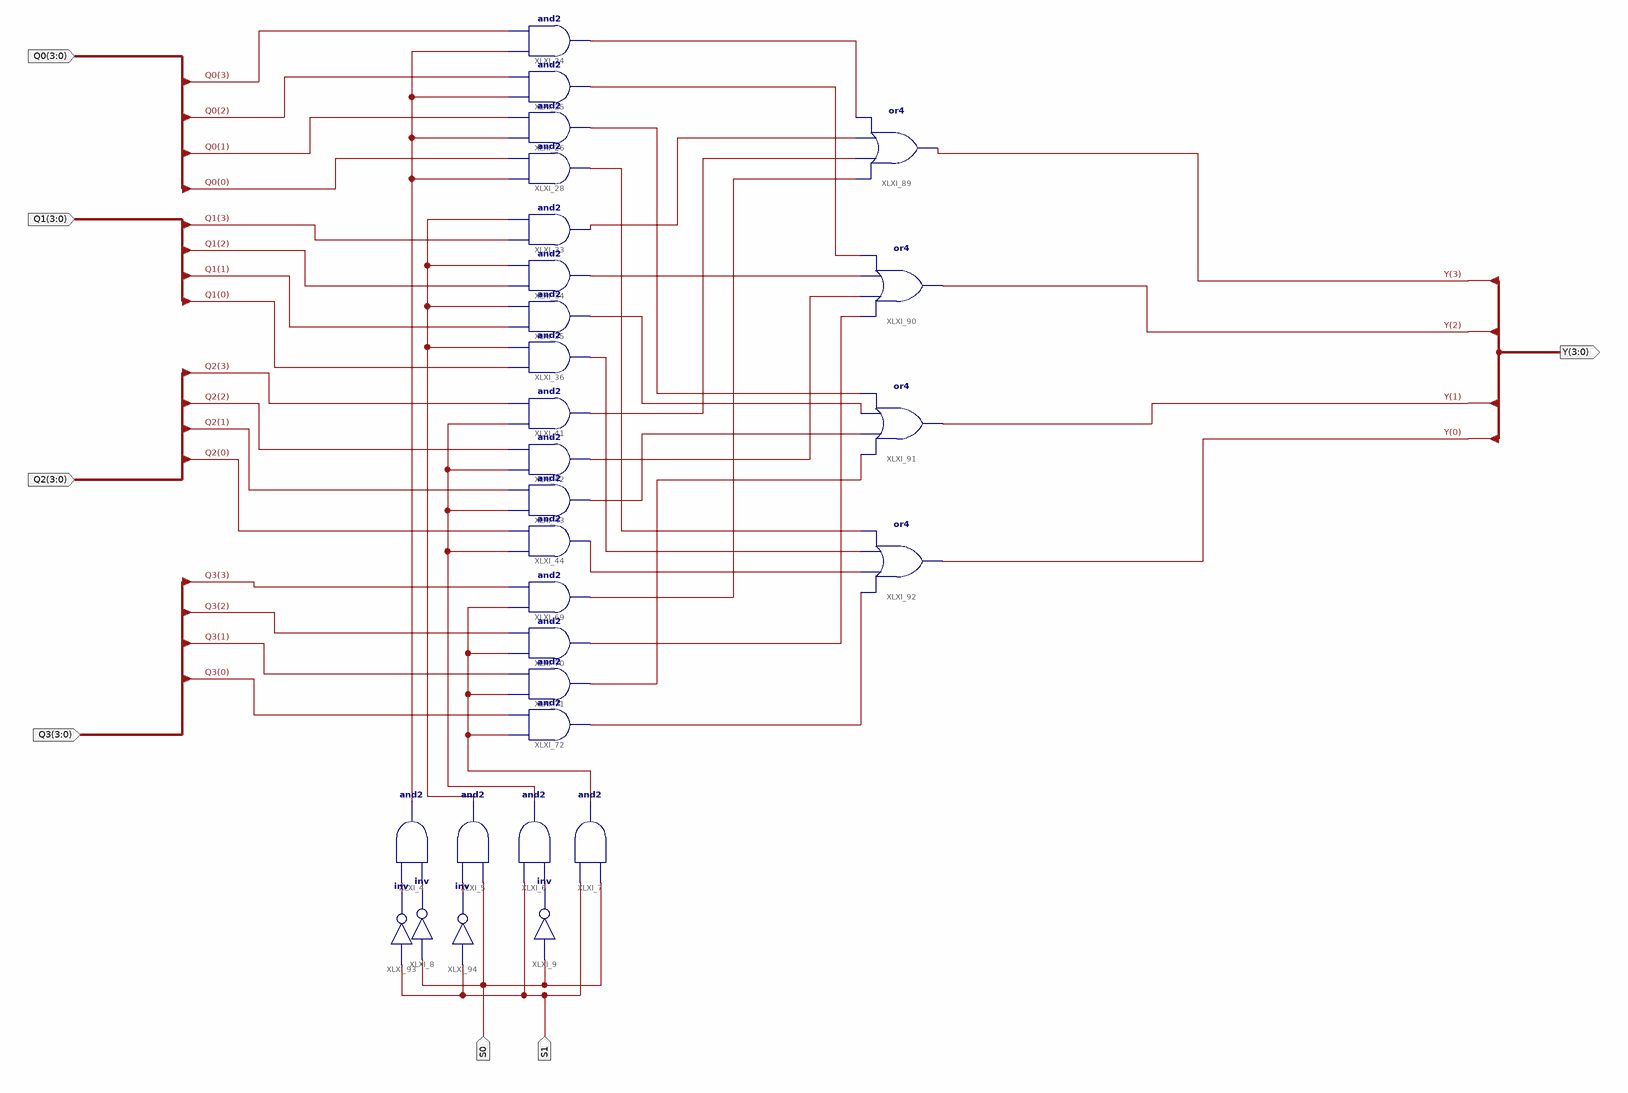
[diagram p0: schematic sheet 1]
// Xilinx ISE schematic MUX4_1_4.sch (spartan6) as structural Verilog: 28 symbols, 7 ports
module MUX4_1_4 (
  input  [3:0] Q0,
  input  [3:0] Q1,
  input  S0,
  input  S1,
  input  [3:0] Q2,
  input  [3:0] Q3,
  output [3:0] Y
);

  wire XLXN_80, XLXN_83, XLXN_121, XLXN_142, XLXN_148, XLXN_150, XLXN_158, XLXN_159, XLXN_160, XLXN_161,
       XLXN_162, XLXN_163, XLXN_164, XLXN_165, XLXN_173, XLXN_174, XLXN_175, XLXN_180, XLXN_182, XLXN_183,
       XLXN_184, XLXN_185, XLXN_190, XLXN_191;

  and XLXI_4 (XLXN_121, XLXN_80, XLXN_190);
  and XLXI_5 (XLXN_142, S0, XLXN_191);
  and XLXI_6 (XLXN_148, XLXN_83, S1);
  and XLXI_7 (XLXN_150, S0, S1);
  not XLXI_8 (XLXN_80, S0);
  not XLXI_9 (XLXN_83, S0);
  and XLXI_24 (XLXN_158, XLXN_121, Q0[3]);
  and XLXI_25 (XLXN_162, XLXN_121, Q0[2]);
  and XLXI_26 (XLXN_173, XLXN_121, Q0[1]);
  and XLXI_28 (XLXN_182, XLXN_121, Q0[0]);
  and XLXI_33 (XLXN_159, Q1[3], XLXN_142);
  and XLXI_34 (XLXN_163, Q1[2], XLXN_142);
  and XLXI_35 (XLXN_174, Q1[1], XLXN_142);
  and XLXI_36 (XLXN_183, Q1[0], XLXN_142);
  and XLXI_41 (XLXN_160, XLXN_148, Q2[3]);
  and XLXI_42 (XLXN_164, XLXN_148, Q2[2]);
  and XLXI_43 (XLXN_175, XLXN_148, Q2[1]);
  and XLXI_44 (XLXN_184, XLXN_148, Q2[0]);
  and XLXI_69 (XLXN_161, XLXN_150, Q3[3]);
  and XLXI_70 (XLXN_165, XLXN_150, Q3[2]);
  and XLXI_71 (XLXN_180, XLXN_150, Q3[1]);
  and XLXI_72 (XLXN_185, XLXN_150, Q3[0]);
  or XLXI_89 (Y[3], XLXN_161, XLXN_160, XLXN_159, XLXN_158);
  or XLXI_90 (Y[2], XLXN_165, XLXN_164, XLXN_163, XLXN_162);
  or XLXI_91 (Y[1], XLXN_180, XLXN_175, XLXN_174, XLXN_173);
  or XLXI_92 (Y[0], XLXN_185, XLXN_184, XLXN_183, XLXN_182);
  not XLXI_93 (XLXN_190, S1);
  not XLXI_94 (XLXN_191, S1);
endmodule
